# EAGLE design esp8266_ir_blaster (EAGLE 9.1.0)
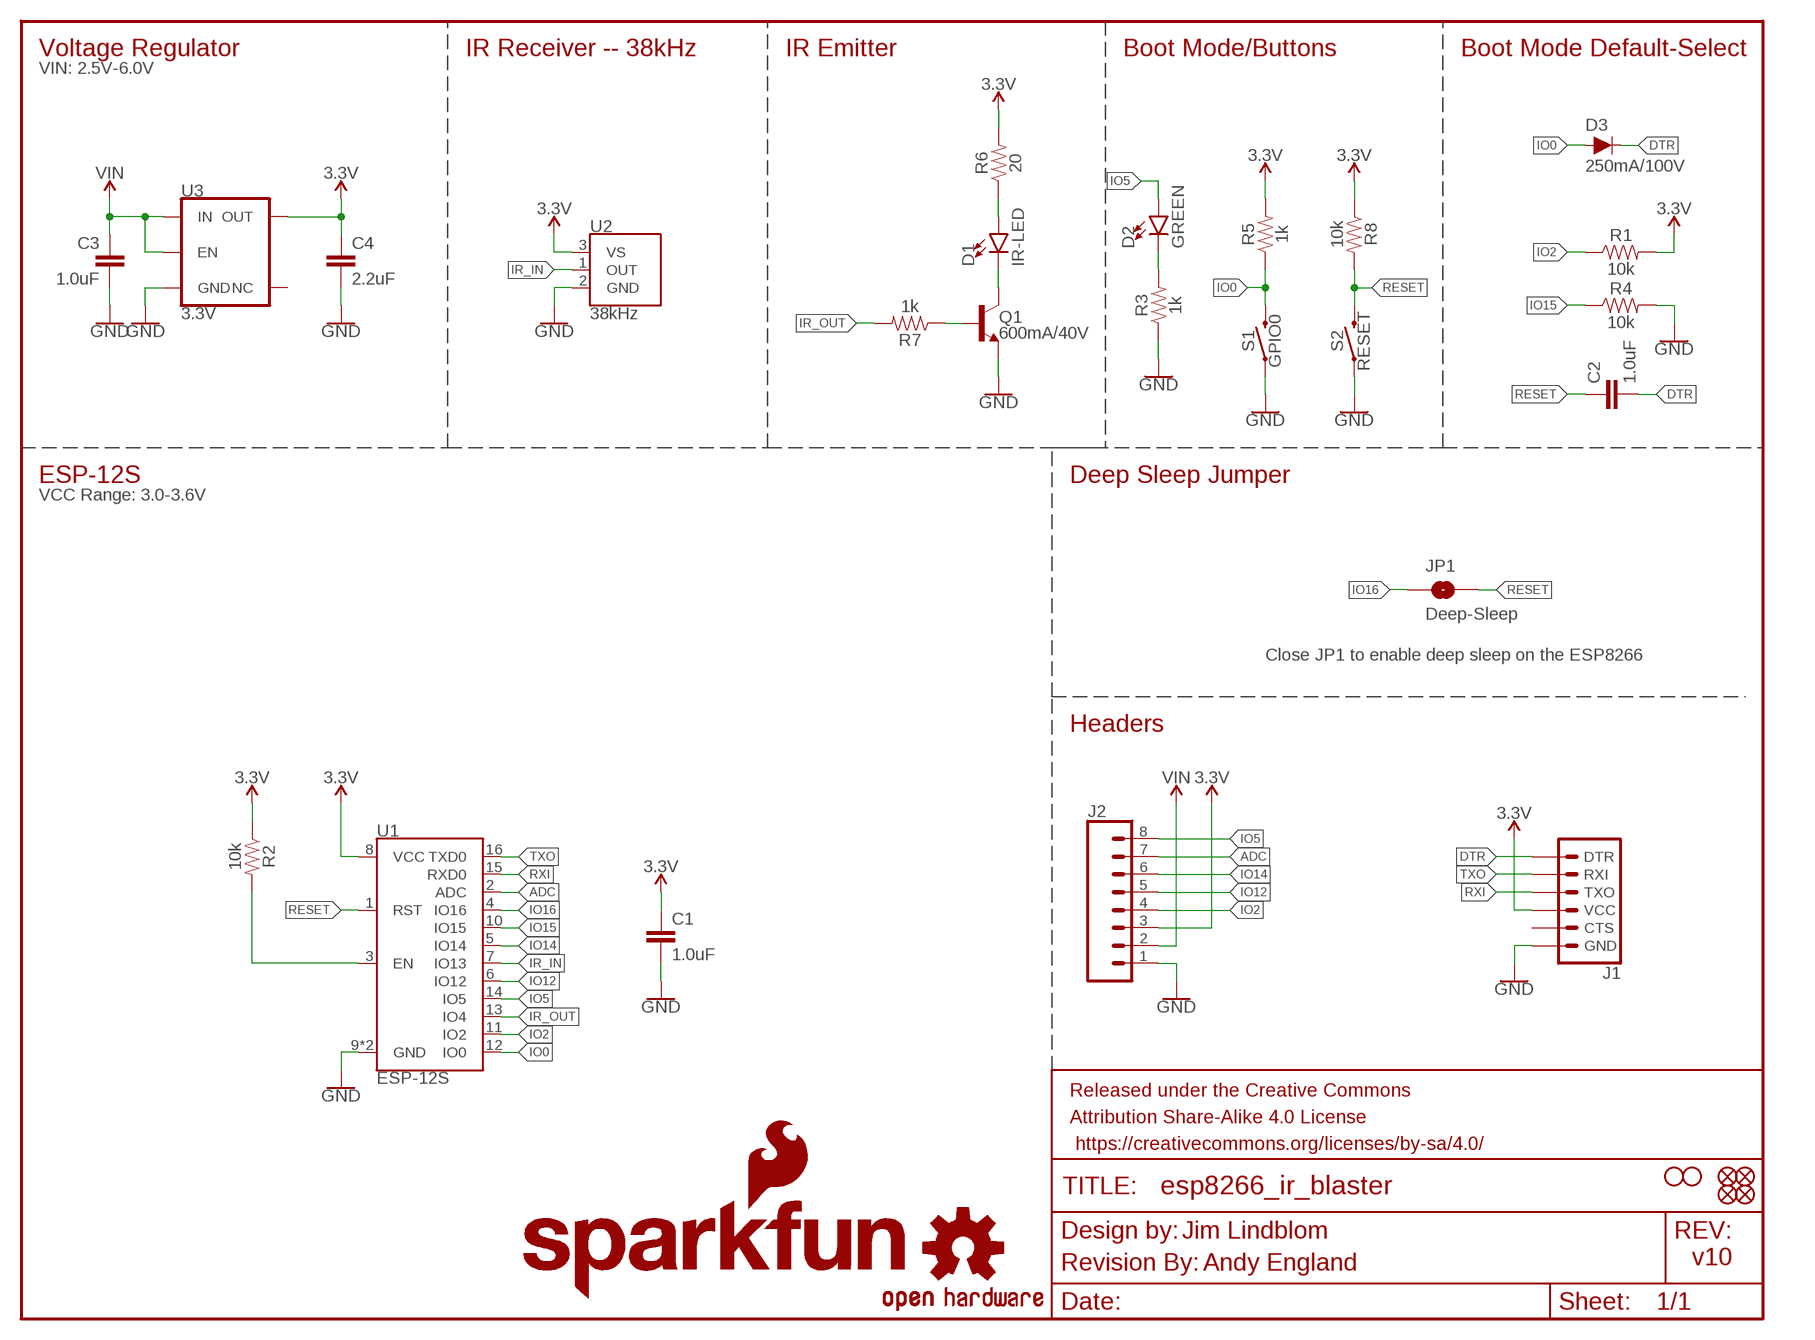
[diagram p0: schematic, sheet 1]

## Parts
C1  1.0uF  1.0UF-0603-16V-10%  [0603]
C2  1.0uF  1.0UF-0603-16V-10%  [0603]
C3  1.0uF  1.0UF-0603-16V-10%  [0603]
C4  2.2uF  2.2UF-0603-10V-20%  [0603]
D1  IR-LED  LED-IRSIDE_EMITTER  [LTE-302]
D2  GREEN  LED-GREEN0603  [LED-0603]
D3  250mA/100V  DIODE-BAS16J  [SOD-323]
FD1  FIDUCIALUFIDUCIAL  [FIDUCIAL-MICRO]
FD2  FIDUCIALUFIDUCIAL  [FIDUCIAL-MICRO]
FD3  FIDUCIALUFIDUCIAL  [FIDUCIAL-MICRO]
FD4  FIDUCIALUFIDUCIAL  [FIDUCIAL-MICRO]
FRAME1  FRAME-LETTER  [CREATIVE_COMMONS]
H1  STAND-OFF  [STAND-OFF]
H2  STAND-OFF  [STAND-OFF]
J1  6_PIN_SERIAL_TARGETNO_SILK  [1X06_NO_SILK]
J2  CONN_08NO_SILK_FEMALE_PTH  [1X08_NO_SILK]
JP1  Deep-Sleep  JUMPER-SMT_2_NO_NO-SILK  [SMT-JUMPER_2_NO_NO-SILK]
LOGO1  OSHW-LOGOS  [OSHW-LOGO-S]
LOGO2  SFE_LOGO_NAME_FLAME.1_INCH  [SFE_LOGO_NAME_FLAME_.1]
LOGO3  REVISION  [REVISION]
Q1  600mA/40V  TRANS_NPN-MMBT2222AL  [SOT23-3]
R1  10k  10KOHM-0603-1/10W-1%  [0603]
R2  10k  10KOHM-0603-1/10W-1%  [0603]
R3  1k  1KOHM-0603-1/10W-1%  [0603]
R4  10k  10KOHM-0603-1/10W-1%  [0603]
R5  1k  1KOHM-0603-1/10W-1%  [0603]
R6  20  20OHM-0603-1/10W-1%  [0603]
R7  1k  1KOHM-0603-1/10W-1%  [0603]
R8  10k  10KOHM-0603-1/10W-1%  [0603]
S1  GPIO0  MOMENTARY-SWITCH-SPST-SMD-4.6X2.8MM  [TACTILE_SWITCH_SMD_4.6X2.8MM]
S2  RESET  MOMENTARY-SWITCH-SPST-SMD-4.6X2.8MM  [TACTILE_SWITCH_SMD_4.6X2.8MM]
U1  ESP-12S  [ESP-12S]
U2  38kHz  TSOP38238  [TSOP382]
U3  3.3V  V_REG_AP2112K-3.3V  [SOT23-5]

## Nets
3.3V: C1.1 C4.1 J1.4(VCC) J2.3 R1.2 R2.1 R5.2 R6.2 R8.1 U1.8(VCC) U2.3(VS) U3.5(OUT)
ADC: J2.7 U1.2(ADC)
CHIP_EN: R2.2 U1.3(EN)
DTR: C2.2 D3.C J1.1(DTR)
GND: C1.2 C3.2 C4.2 J1.6(GND) J2.1 Q1.2(E) R3.1 R4.2 S1.1 S1.2 S2.1 S2.2 U1.9(GND) U1.P$1(GND) U2.2(GND) U3.2(GND)
IO0: D3.A R5.1 S1.3 S1.4 U1.12(IO0)
IO2: J2.4 R1.1 U1.11(IO2)
IO5: D2.A J2.8 U1.14(IO5)
IO12: J2.5 U1.6(IO12)
IO14: J2.6 U1.5(IO14)
IO15: R4.1 U1.10(IO15)
IO16: JP1.1 U1.4(IO16)
IR_IN: U1.7(IO13) U2.1(OUT)
IR_OUT: R7.2 U1.13(IO4)
N$1: D2.C R3.2
N$5: D1.C Q1.3(C)
N$6: D1.A R6.1
N$7: Q1.1(B) R7.1
RESET: C2.1 JP1.2 R8.2 S2.3 S2.4 U1.1(RST)
RXI: J1.3(TXO) U1.15(RXD0)
TXO: J1.2(RXI) U1.16(TXD0)
VIN: C3.1 J2.2 U3.1(IN) U3.3(EN)
Unconnected: J1.5(CTS) U3.4(NC)

## Notes on the sheet
- Voltage Regulator | IR Receiver -- 38kHz | IR Emitter | Boot Mode/Buttons | Boot Mode Default-Select
- VIN: 2.5V-6.0V
- ESP-12S | Deep Sleep Jumper
- VCC Range: 3.0-3.6V
- Close JP1 to enable deep sleep on the ESP8266
- Headers
- Jim Lindblom
- Andy England | v10

## Library data of the parts
C1-C3 = SparkFun-Capacitors:1.0UF: 1µF ceramic capacitors A capacitor is a passive two-terminal electrical component used to store electrical energy temporarily in an electric field.; PROD_ID: CAP-00868
C4 = SparkFun-Capacitors:2.2UF: 2.2µF ceramic capacitors A capacitor is a passive two-terminal electrical component used to store electrical energy temporarily in an electric field.; PROD_ID: CAP-07888
D1 = SparkFun-LED:LED-IR: Infrared LED (IR) Wavelength: 940nm Packages: TSAL6100 LTE302 - Side firing. Check SparkFun-Sensors.lbr for the receiver SparkFun Products: ZX Distance and Gesture Sensor <[https://www.sparkfun.com/products/12780]> Infrared Emitters and Detectors <https://www.sparkfun.com/products/241>; PROD_ID: DIO-10904; SF_ID: SEN-00241
D2 = SparkFun-LED:LED-GREEN: Green SMD LED Used in manufacturing of various products at SparkFun Packages: 0603 - SMD 0603 package [Product Link] <http://www.futureelectronics.com/en/technologies/semiconductors/optoelectronics/leds/Pages/9894312-LTST-C190GKT.aspx?CrossPart=HSMG-C190&IM=0> LilyPad 1206 - SMD1206 LilyPad package [Product Link] <http://www.futureelectronics.com/en/Technologies/Product.aspx?ProductID=IN150NGHARVATEKCORPORATION2049943&IM=0> 1206 - SMD1206 package [Product Link] <http://www.futureelectronics.com/en/technologies/semiconductors/optoelectronics/leds/Pages/8315665-LTST-C150KGKT.aspx?IM=0> 1206 Bottom Mount -SMD 1206 Bottom Mount [Product Link] <http://www.digikey.com/product-detail/en/lite-on-inc/LTST-C230KGKT/160-1456-1-ND/386854> SparkFun Products: Pro Mini 328 -5V <https://www.sparkfun.com/products/821> RedBoard <https://www.sparkfun.com/products/12757> MP3 Trigger <https://www.sparkfun.com/products/13720> Makey Makey <https://www.sparkfun.com/products/11076>; PROD_ID: DIO-00821
D3 = SparkFun-DiscreteSemi:DIODE: Diode These are standard reverse protection diodes and small signal diodes. SparkFun Products: SparkFun SparkPunk Sound Kit <https://www.sparkfun.com/products/11177> SparkFun ESP8266 Thing <https://www.sparkfun.com/products/13231>; PROD_ID: DIO-09646
FD1-FD4 = SparkFun-Aesthetics:FIDUCIAL: Fiducial Alignment Points Point-of-reference for pick-and-place machines and other optical instruments.
FRAME1 = SparkFun-Aesthetics:FRAME-LETTER: Schematic Frame - Letter Standard 8.5x11 US Letter frame
H1 H2 = SparkFun-Hardware:STAND-OFF: Stand Off Drill holes for mechanically mounting via screws, standoffs, etc. Note: Use the keepout ring to avoid running the screw head into surrounding components. Variant Overviews STAND-OFF - Mechanical footprint for a #4 phillips button head screw. STAND-OFF-TIGHT - Mechanical footprint for a #4 phillips button head screw, Example SparkFun Products Screw - Phillips Head (1/4", 4-40, 10 pack) <https://www.sparkfun.com/products/10453> (PRT-10453) Screw - Phillips Head (1/2", 4-40, 10 pack) <https://www.sparkfun.com/products/10452> (PRT-10452) Screw - Phillips Head (3/4", 4-40, 10 pack) <https://www.sparkfun.com/products/10451> (PRT-10451) Screw - Phillips Head (1", 4-40, 10 pack) <https://www.sparkfun.com/products/10450> (PRT-10450)
J1 = SparkFun-Connectors:6_PIN_SERIAL_TARGET: 6-pin header connection for use with the "FTDI BASIC" pinout - TARGET SIDE. Also known as "Arduino Serial Program Header". It is used to mate with our FTDI Basic serial programmers using the Arduino IDE. Note, this device has "TARGET" in the name. It is intended to be used on a design that contains a target micro-controller that you wish to program. The "sister" device, named "CABLE" is inteneded to be used on a design that usually lives on the end of your USB cable and prvides the converter chip (FTDI232 or FTDI231x) to commnicate serial RX/TX. You can populate with some of these: Break Away Headers - Straight <https://www.sparkfun.com/products/116> (PRT-00116) For reference (or to suit your programming needs) check out these designs: SparkFun FTDI Basic Breakout - 5V <https://www.sparkfun.com/products/9716> (DEV-09716) SparkFun FTDI Basic Breakout - 3.3V <https://www.sparkfun.com/products/9873> (DEV-09873) SparkFun FTDI SmartBasic <https://www.sparkfun.com/products/12935> (DEV-12935) SparkFun Beefy 3 - FTDI Basic Breakout <https://www.sparkfun.com/products/13746> (DEV-13746)
J2 = SparkFun-Connectors:CONN_08: Multi connection point. Often used as Generic Header-pin footprint for 0.1 inch spaced/style header connections On any of the 0.1 inch spaced packages, you can populate with these: Break Away Headers - Straight <https://www.sparkfun.com/products/116> (PRT-00116) Break Away Male Headers - Right Angle <https://www.sparkfun.com/products/553> (PRT-00553) Female Headers <https://www.sparkfun.com/products/115> (PRT-00115) Break Away Headers - Machine Pin <https://www.sparkfun.com/products/117> (PRT-00117) Break Away Female Headers - Swiss Machine Pin <https://www.sparkfun.com/products/743> (PRT-00743) Arduino Stackable Header - 8 Pin <https://www.sparkfun.com/products/9279> (PRT-09279) For SCREWTERMINALS and SPRING TERMINALS visit here: Screw Terimnals on SparkFun.com <https://www.sparkfun.com/search/results?term=Screw+Terminals> (5mm/3.5mm/2.54mm spacing) This device is also useful as a general connection point to wire up your design to another part of your project. Our various solder wires solder well into these plated through hole pads. Hook-Up Wire - Assortment (Stranded, 22 AWG) <https://www.sparkfun.com/products/11375> (PRT-11375) Hook-Up Wire - Assortment (Solid Core, 22 AWG) <https://www.sparkfun.com/products/11367> (PRT-11367) View the entire wire category on our website here <https://www.sparkfun.com/categories/141> Special notes: Molex polarized connector foot print use with SKU : PRT-08231 with associated crimp pins and housings. 1MM SMD Version SKU: PRT-10208 NOTES ON THE VARIANTS LOCK and LOCK_LONGPADS... This footprint was designed to help hold the alignment of a through-hole component (i.e. 6-pin header) while soldering it into place. You may notice that each hole has been shifted either up or down by 0.005 of an inch from it's more standard position (which is a perfectly straight line). This slight alteration caused the pins (the squares in the middle) to touch the edges of the holes. Because they are alternating, it causes a "brace" to hold the component in place. 0.005 has proven to be the perfect amount of "off-center" position when using our standard breakaway headers. Although looks a little odd when you look at the bare footprint, once you have a header in there, the alteration is very hard to notice. Also,if you push a header all the way into place, it is covered up entirely on the bottom side.; PROD_ID: CONN-08438
JP1 = SparkFun-Jumpers:JUMPER-SMT_2_NO: Normally open jumper This jumper has two pads in close proximity to each other. Apply solder to close the connection. Round pads are easier to solder for beginners, but are a lot larger. SparkFun Product that uses the round pads: SparkFun EL Sequencer <https://www.sparkfun.com/products/12781>
LOGO1 = SparkFun-Aesthetics:OSHW-LOGO: Open-Source Hardware (OSHW) Logo This logo indicates the piece of hardware it is found on incorporates a OSHW license and/or adheres to the definition of open source hardware found here: http://freedomdefined.org/OSHW
LOGO2 = SparkFun-Aesthetics:SFE_LOGO_NAME_FLAME: SparkFun Font Logo w/ Flame This is the SparkFun full logo. The logo on the schematic will always be the same size; the package variant is the height of the flame part of the logo. Default layer for the logo on the board is tSilk.
LOGO3 = SparkFun-Aesthetics:REVISION: "Revision By" Text Preceding text for revisor documentation. Includes schematic text on "symbols" layer, and board text on tDoc.
Q1 = SparkFun-DiscreteSemi:TRANS_NPN: NPN transistor Current controlled devices typically used to amplify current or used as a switch. BC547 - COM-08928 <http://www.sparkfun.com/products/8928> (TO-92 45V 100mA) (1.Collector 2.Base 3.Emitter) 2N3904 - COM-00521 <http://www.sparkfun.com/products/521> (TO-92 40V 200mA) (1.Emitter 2.Base 3.Collector) P2N2222A - COM-12852 <http://www.sparkfun.com/products/12852> (TO-92 40V 600mA) (1.Collector 2.Base 3.Emitter); PROD_ID: TRANS-08049
R1 R2 R4 R8 = SparkFun-Resistors:10KOHM: 10kΩ resistor A resistor is a passive two-terminal electrical component that implements electrical resistance as a circuit element. Resistors act to reduce current flow, and, at the same time, act to lower voltage levels within circuits. - Wikipedia; PROD_ID: RES-00824
R3 R5 R7 = SparkFun-Resistors:1KOHM: 1kΩ resistor A resistor is a passive two-terminal electrical component that implements electrical resistance as a circuit element. Resistors act to reduce current flow, and, at the same time, act to lower voltage levels within circuits. - Wikipedia; PROD_ID: RES-07856
R6 = SparkFun-Resistors:20OHM: RES-07862; PROD_ID: RES-07862
S1 S2 = SparkFun-Switches:MOMENTARY-SWITCH-SPST: Momentary Switch (Pushbutton) - SPST Normally-open (NO) SPST momentary switches (buttons, pushbuttons). Variants PTH-12MM - 12mm square, through-hole Momentary Pushbutton Switch - 12mm Square <https://www.sparkfun.com/products/9190> (COM-09190) PTH-6.0MM, PTH-6.0MM-KIT - 6.0mm square, through-hole Mini Pushbutton Switch <https://www.sparkfun.com/products/97> (COM-00097) KIT package intended for soldering kit's - only one side of pads' copper is exposed. PTH-RIGHT-ANGLE-KIT - Right-angle, through-hole Right Angle Tactile Button <https://www.sparkfun.com/products/10791> - Used on SparkFun BigTime Watch Kit <https://www.sparkfun.com/products/11734> SMD-12MM - 12mm square, surface-mount Tactile Button - SMD (12mm) <https://www.sparkfun.com/products/12993> (COM-12993) Used on SparkFun PicoBoard <https://www.sparkfun.com/products/11888> SMD-4.5MM - 4.5mm Square Trackball Switch Used on SparkFun Blackberry Trackballer Breakout <https://www.sparkfun.com/products/13169> SMD-4.6MMX2.8MM - 4.60mm x 2.80mm, surface mount Used on SparkFun SAMD21 Mini Breakout <https://www.sparkfun.com/products/13664> SMD-5.2MM, SMD-5.2-REDUNDANT - 5.2mm square, surface-mount Mini Pushbutton Switch - SMD <https://www.sparkfun.com/products/8720> (COM-08720) Used on Arduino Pro Mini <https://www.sparkfun.com/products/11114> REDUNDANT package connects both switch circuits together SMD-6.0X3.5MM - 6.0 x 3.5mm, surface mount Momentary Reset Switch SMD <https://www.sparkfun.com/products/8229> (COM-08229) SMD-6.2MM-TALL - 6.2mm square, surface mount Tactile Button - SMD (6mm) <https://www.sparkfun.com/products/12992> Used on SparkFun Digital Sandbox <https://www.sparkfun.com/products/12651> SMD-RIGHT-ANGLE - Right-angle, surface mount Used on SparkFun Block for Intel® Edison - Arduino <https://www.sparkfun.com/products/13036>; PROD_ID: SWCH-13065
U1 = SparkFun-RF:ESP-12S: AI-Thinker ESP-12S ESP-12S WiFi module is developed by AI-Thinker Co.,Ltd, core processor ESP8266 in smaller sizes of the module encapsulates Tensilica L106 integrates industry-leading ultra low power 32-bit MCU micro, with the 16-bit short mode, clock speed support 80 MHz, 160 MHz, supports the RTOS, integrated Wi-Fi MAC/BB/RF/PA/LNA, on-board antennas.; PROD_ID: IC-14115
U2 = SparkFun-Sensors:TSOP382: Vishay Semiconductor TSOP32838 - 38kHz IR Receiver These products are miniaturized IR receiver modules for infrared remote control systems. A PIN diode and a preamplifier are assembled on a leadframe, the epoxy package contains an IR filter. The demodulated output signal can be directly connected to a microprocessor for decoding.; PROD_ID: SEN-14114
U3 = SparkFun-IC-Power:V_REG_AP2112: AP2112 - 600mA CMOS LDO Regulator w/ Enable The AP2112 is CMOS process low dropout linear regulator with enable function, the regulator delivers a guaranteed 600mA (min.) continuous load current. Features Output Voltage Accuracy: ±1.5% Output Current: 600mA (Min.) Foldback Short Current Protection: 50mA Enable Function to Turn ON/OFF VOUT Low Dropout Voltage (3.3V): 250mV (Typ.) @IOUT=600mA Excellent Load Regulation: 0.2%/A (Typ.) Excellent Line Regulation: 0.02%/V (Typ.) Low Quiescent Current: 55μA (Typ.) Low Standby Current: 0.01μA (Typ.) Low Output Noise: 50μVRMS PSRR: 100Hz -65dB, 1kHz -65dB OTSD Protection Stable with 1.0μF Flexible Cap: Ceramic, Tantalum and Aluminum Electrolytic Operation Temperature Range: -40°C to 85°C ESD: MM 400V, HBM 4000V; PROD_ID: VREG-12457

## Board
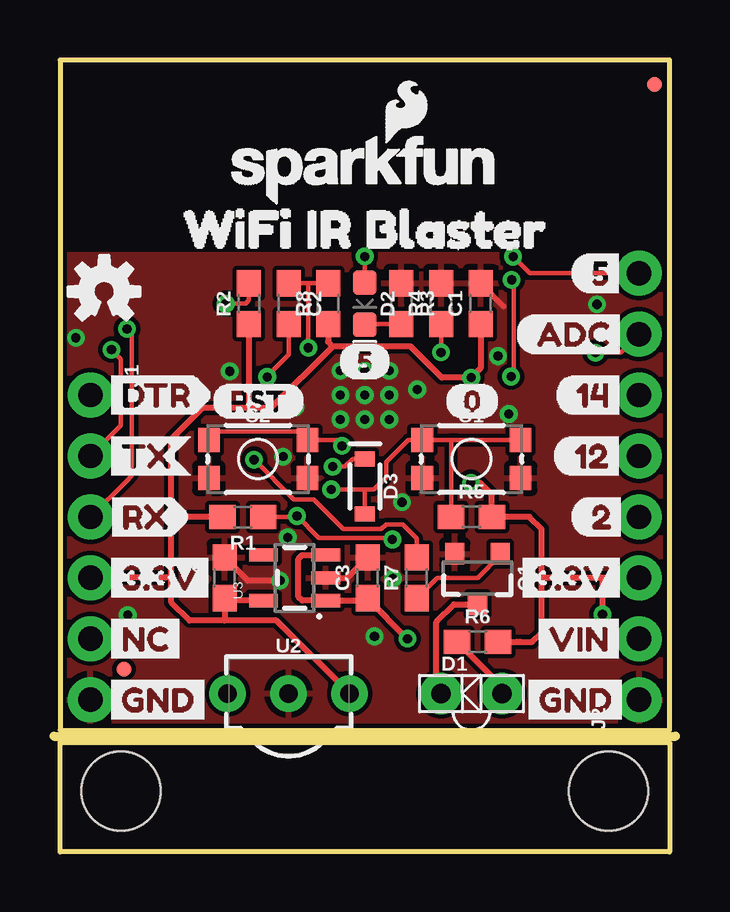
[diagram p1: board, top side]
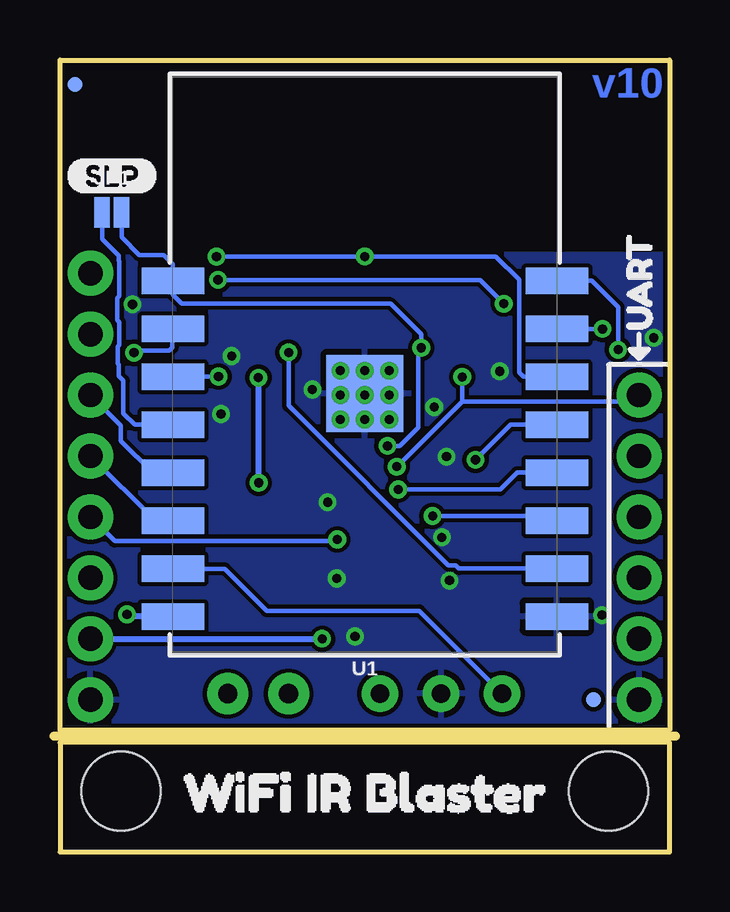
[diagram p2: board, bottom side, seen from below]

Size 25.4 x 33.02 mm. Coordinates in mm from the lower left corner, seen from the top.
Outline: 0,5.08 25.4,5.08 25.4,33.02 0,33.02 0,5.08
Outline: 0,4.57 25.4,4.57 25.4,0 0,0 0,4.57
Copper layers (1*16): Top 0.035mm / dielectric 1.5mm / Bottom 0.035mm
Design rules "SparkFun-2-layer-TIGHT": minimum track width 7mil, minimum drill 15mil, track to track 7mil, track to pad 7mil, pad to pad 7mil, via to via 7mil, smd to smd 7mil, copper to edge 7mil, drill to drill 7mil, minimum pad ring 7mil, minimum via ring 7mil, stop-mask expansion 4mil, vias tented up to drill 25mil, thermal gap 10mil
Milling: 1 lines

### Footprints (pad centres in the part's own frame; a part is rotated, then mirrored left to right if it is on the bottom)
0603 = smd 1.1 x 1: 1 -0.85,0; 2 0.85,0
LTE-302 = drill 0.8 pad 1.714: A 1.27,0; C -1.27,0
LED-0603 = smd 1 x 1: A -0.877,0; C 0.877,0
SOD-323 = smd 0.63 x 0.83: A 1.15,0; C -1.15,0
FIDUCIAL-MICRO = smd 0.635 x 0.635: 1 0,0
STAND-OFF = hole 3.302: 0,0
1X06_NO_SILK = drill 1.016 pad 1.88: 1 0,0; 2 2.54,0; 3 5.08,0; 4 7.62,0; 5 10.16,0; 6 12.7,0
1X08_NO_SILK = drill 1.016 pad 1.88: 1 0,0; 2 2.54,0; 3 5.08,0; 4 7.62,0; 5 10.16,0; 6 12.7,0; 7 15.24,0; 8 17.78,0
SMT-JUMPER_2_NO_NO-SILK = smd 0.635 x 1.27: 1 -0.406,0; 2 0.406,0
SOT23-3 = smd 0.8 x 0.9: 1 -0.95,-1; 2 0.95,-1; 3 0,1.1
TACTILE_SWITCH_SMD_4.6X2.8MM = smd 0.9 x 1: 1 -2.05,-0.8; 2 2.05,-0.8; 3 2.05,0.8; 4 -2.05,0.8
ESP-12S = smd 2.6 x 1.1: 1 -8,3.5; 2 -8,1.5; 3 -8,-0.5; 4 -8,-2.5; 5 -8,-4.5; 6 -8,-6.5; 7 -8,-8.5; 8 -8,-10.5; 9 8,-10.5; 10 8,-8.5; 11 8,-6.5; 12 8,-4.5; 13 8,-2.5; 14 8,-0.5; 15 8,1.5; 16 8,3.5 | smd 3.2 x 3.2: P$1 0,-1.2
TSOP382 = drill 0.762 pad 1.524: 1 -2.54,0; 2 0,0; 3 2.54,0
SOT23-5 = smd 0.55 x 1.2: 1 -0.95,-1.3; 2 0,-1.3; 3 0.95,-1.3; 4 0.95,1.3; 5 -0.95,1.3

### Placement (x,y rotation side)
C1  17.53,22.86 90 top
C2  9.53,22.86 270 top
C3  12.83,11.43 90 top
C4  6.86,11.43 90 top
D1  17.14,6.6 0 top
D2  12.7,22.86 270 top
D3  12.7,15.24 270 top
FD1  24.77,32 0 top
FD2  2.67,7.62 0 top
FD3  3.17,6.35 0 bottom
FD4  24.77,32 0 bottom
FRAME1  -11.43,-25.4 0 top  (outside the outline)
H1  22.86,2.54 0 bottom
H2  2.54,2.54 0 bottom
J1  1.27,19.05 270 top
J2  24.13,6.35 90 top
JP1  23.24,26.67 0 bottom
LOGO1  1.84,23.37 0 top
LOGO2  6.73,26.92 0 top
LOGO3  0,-27.94 0 top  (outside the outline)
Q1  17.4,11.43 180 top
R1  7.62,13.97 180 top
R2  7.87,22.86 90 top
R3  14.22,22.86 270 top
R4  15.88,22.86 90 top
R5  17.14,13.97 0 top
R6  17.4,8.76 0 top
R7  14.86,11.43 90 top
R8  11.18,22.86 90 top
S1  17.14,16.38 0 top
S2  8.26,16.38 0 top
U1  12.7,20.32 0 bottom
U2  9.53,6.6 0 top
U3  9.78,11.43 90 top
U$1  [512]  11.56,20.45 0 top
U$2  [3#3V4]  18.8,11.43 0 top
U$3  [SLP14]  25.15,28.19 0 bottom
U$4  [WIFI_IR_BLASTER11]  21.62,2.46 0 bottom
U$5  [UART0]  1.27,20.83 90 bottom
U$6  [DTR1]  1.65,19.05 0 top
U$7  [NC0]  1.65,8.89 0 top
U$8  [511]  21.21,24.13 0 top
U$9  [ADC10]  18.92,21.59 0 top
U$10  [129]  20.32,16.51 0 top
U$11  [148]  20.57,19.05 0 top
U$12  [27]  21.21,13.97 0 top
U$13  [WIFI_IR_BLASTER11]  3.78,25.96 0 top
U$14  [013]  16,18.8 0 top
U$15  [RST14]  6.29,18.8 0 top
U$19  [TX2]  1.65,16.51 0 top
U$20  [RX3]  1.65,13.97 0 top
U$21  [3#3V4]  1.65,11.43 0 top
U$22  [GND5]  1.65,6.35 0 top
U$23  [VIN6]  19.43,8.89 0 top
U$24  [GND5]  19.05,6.35 0 top

### Tracks (layer width: path | path; a pad name or v marks a point on that pad's centre or on a via)
3.3V  (via drill 0.38)
  Top 0.178: R8.1 11.18,21.59
  Top 0.254: C1.1 17.53,20.17 v17.13,19.78 15.91,19.78 14.61,21.08 11.37,21.08 | U3.5 6.96,10.48 C4.1 6.86,9.65 | U2.3 9.02,9.65 6.86,9.65 | J1.4 1.28,11.44 3.76,11.44 | 4.39,11.44 4.64,11.44 4.64,13.97 | v22.61,9.91 22.61,11.43 | R2.1 7.87,18.51 | J2.3 22.61,11.43 | R6.2 19.05,8.76 | 19.05,8.76 19.18,8.76 | 7.87,18.51 8.79,18.51 11.37,21.08 | 11.18,21.59 11.18,21.27 11.37,21.08 | 7.87,18.51 5.93,18.51 4.64,17.21 4.64,13.97 | R1.2 4.64,13.97 | 6.86,9.65 5.4,9.65 4.64,10.4 4.64,11.44 4.39,11.44 | 3.76,11.44 | 4.39,11.44 3.76,11.44 | 19.05,8.76 19.68,8.76 20.07,9.14 20.07,11.43 | 20.07,11.43 20.07,13.46 19.56,13.97 R5.2 18,14.9 17.5,15.39 v17.12,15.39 | 22.61,11.43 20.07,11.43
  Bottom 0.254: U1.8 22.52,9.82 v22.61,9.91 | v17.13,19.78 17.13,15.41 v17.12,15.39
ADC  (via drill 0.38)
  Top 0.178: J2.7 23.36,20.82 v22.31,20.82
  Bottom 0.178: U1.2 20.71,21.81 20.71,21.03 20.84,20.9 22.23,20.9 v22.31,20.82
CHIP_EN  (via drill 0.38)
  Top 0.178: v18.82,23.85 18.91,23.76 18.91,19.93 v18.8,19.82 | R2.2 7.87,23 7.73,22.86 v6.91,22.86
  Bottom 0.178: U1.3 v18.8,19.82 | v6.91,22.86 7.9,23.85 v18.82,23.85
DTR  (via drill 0.38)
  Top 0.178: v8.64,19.8 8.64,19.85 9.53,20.74 C2.2 | D3.C 12.2,16.39 11.87,16.07 v11.37,16.07
  Bottom 0.178: 8.64,18.79 11.36,16.07 v11.37,16.07 | v8.64,19.8 8.64,18.79 | 8.64,18.79 1.53,18.79 J1.1
GND  (via drill 0.38)
  Top 0.254: U3.2 11.98,11.43 C3.2 | C4.2 7.82,11.32 v9.17,11.32 | C1.2 18.48,22.76
  other vias: 2.82,9.88 9.49,13.12 13.87,11.4 14.25,14.58 13.11,8.99 0.66,21.44 18.25,20.68 18.69,18.26 7.07,20.04 14.88,19.28 9.3,16.48 22.38,22.83 12.7,19.05 12.7,18.03 13.72,18.03 13.72,19.05 12.7,20.07 13.72,20.07 11.68,20.07 11.68,19.05 11.68,18.03 9.8,18.55
  pour Top (isolate 0.152): 0,24.89 0,5.08 25.4,5.08 25.4,24.89
  pour Bottom (isolate 0.152): 25.4,24.89 25.4,5.08 0,5.08 0,24.89
IO0  (via drill 0.38)
  Top 0.178: 16.51,17.18 15.24,17.18 S1.4 14.52,17.18 13.59,16.26 13.59,15.62 13.08,15.11 12.7,15.11 | 16.51,17.18 S1.3 | R5.1 16.3,17.18 16.51,17.18 | 12.7,15.11 v11.3,15.11 | D3.A 12.7,15.11
  Bottom 0.178: U1.12 6.35,15.82 7.06,15.11 v11.3,15.11
IO2  (via drill 0.38)
  Top 0.178: R1.1 9.84,13.97 v9.88,14.01 10.79,13.1 13.78,13.1 v13.85,13.03
  Bottom 0.178: J2.4 23.13,12.97 13.91,12.97 v13.85,13.03 | U1.11 4.89,14.01 v9.88,14.01
IO5  (via drill 0.38)
  Top 0.178: v18.88,24.82 19.57,24.13 J2.8 | D2.A v12.7,24.83
  Bottom 0.178: U1.14 6.1,19.82 6.27,19.99 6.27,23.86 7.25,24.83 v12.7,24.83 13.91,24.83 13.91,24.82 v18.88,24.82
IO12
  Bottom 0.178: U1.6 21.44,13.82 J2.5
IO14
  Bottom 0.178: U1.5 21.54,15.82 22.86,17.14 22.86,17.78 J2.6
IO15  (via drill 0.38)
  Top 0.178: R4.1 v15.88,20.83
  Bottom 0.178: U1.10 8.78,11.82 8.91,11.95 9.22,11.95 15.88,18.61 v15.88,20.83
IO16
  Bottom 0.178: JP1.1 23.65,25.55 22.95,24.85 22.95,24.66 22.92,24.63 22.92,23.19 23.01,23.1 23.01,22.18 22.92,22.09 22.92,21.13 22.99,21.07 22.99,20.36 22.95,20.32 22.95,19.84 22.76,19.65 22.76,18.29 22.29,17.82 U1.4
IR_IN
  Bottom 0.178: U2.1 10.44,10.06 16.79,10.06 18.54,11.81 20.32,11.81 | 20.32,11.81 U1.7 | U1.7 | U1.7 20.32,11.81
IR_OUT  (via drill 0.38)
  Top 0.178: v8.09,16.35 9.73,14.71 10.57,14.71 11.81,13.46 13.38,13.46 13.59,13.66 14.28,13.66 14.86,13.08 R7.2
  Bottom 0.178: v8.09,16.35 6.62,17.82 U1.13
N$1
  Top 0.178: R3.2 12.73,22.01 D2.C
  Top 0.254: R3.2
N$5
  Top 0.254: D1.C 15.68,6.79 15.68,9.59 16.43,10.33 Q1.3
N$6
  Top 0.254: D1.A 18.41,6.9 R6.1
N$7
  Top 0.178: R7.1 15.71,11.43 17.4,11.43 18.35,12.38 | 18.35,12.38 Q1.1 18.35,12.38
RESET  (via drill 0.38)
  Top 0.178: C2.1 10.35,23.71 | 10.35,23.71 R8.2 | v10.35,21.02 10.35,23.71 | v11.75,16.93 11.5,17.18 S2.3 9.96,17.53 6.55,17.53 S2.4
  Bottom 0.178: JP1.2 | 20.7,24.13 20.7,24.51 21.08,24.89 22.1,24.89 22.84,25.63 JP1.2 | 20.7,24.13 20.7,23.24 20.32,22.86 11.62,22.86 10.35,21.59 v10.35,21.02 10.48,20.89 10.48,17.7 11.25,16.93 v11.75,16.93 | U1.1 20.7,24.13
RXI  (via drill 0.38)
  Top 0.178: J1.3 2.79,15.49 3,15.7 3,20.32 3,21.6 v2.79,21.81
  Bottom 0.178: v2.79,21.81 4.69,21.81 U1.15
TXO  (via drill 0.38)
  Top 0.178: v2.15,20.94 2.54,20.55 2.54,17.78 J1.2
  Bottom 0.178: U1.16 3.25,23.82 2.15,22.72 v2.15,20.94
VIN  (via drill 0.38)
  Top 0.254: v14.48,8.89 12.83,10.54 C3.1 12.73,10.48 U3.1 10.09,10.48 9.93,10.64 9.93,12.22 10.09,12.38 U3.3
  Bottom 0.254: J2.2 v14.48,8.89

### Text on the board
Bottom: v10
tDocu: Jim Lindblom | Andy England